# Altium schematic sheet HeatElement.SchDoc
size A; SheetNumber: 8; SheetTotal: 14
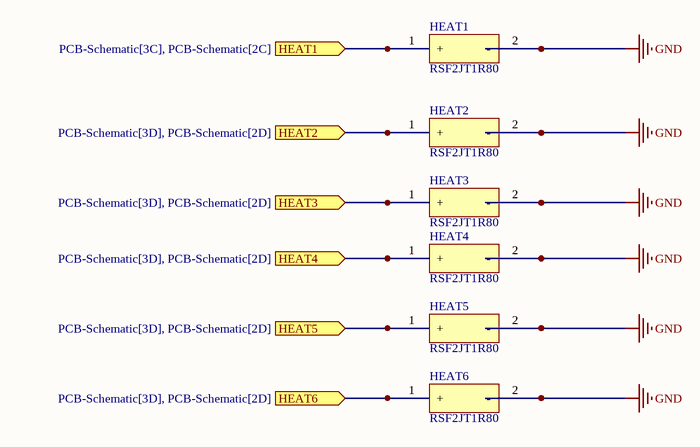
[diagram p0: HeatElement.SchDoc]

## Parts
HEAT1  RSF2JT1R80  [PCBComponent_1]
HEAT2  RSF2JT1R80  [PCBComponent_1]
HEAT3  RSF2JT1R80  [PCBComponent_1]
HEAT4  RSF2JT1R80  [PCBComponent_1]
HEAT5  RSF2JT1R80  [PCBComponent_1]
HEAT6  RSF2JT1R80  [PCBComponent_1]

## Ports
HEAT1 (in, see PCB-Schematic[3C], PCB-Schematic[2C]), HEAT2 (in, see PCB-Schematic[3D], PCB-Schematic[2D]), HEAT3 (in, see PCB-Schematic[3D], PCB-Schematic[2D]), HEAT4 (in, see PCB-Schematic[3D], PCB-Schematic[2D]), HEAT5 (in, see PCB-Schematic[3D], PCB-Schematic[2D]), HEAT6 (in, see PCB-Schematic[3D], PCB-Schematic[2D])

## Nets
GND: HEAT1.2(-) HEAT2.2(-) HEAT3.2(-) HEAT4.2(-) HEAT5.2(-) HEAT6.2(-)
HEAT1: HEAT1.1(+) ; port HEAT1
HEAT2: HEAT2.1(+) ; port HEAT2
HEAT3: HEAT3.1(+) ; port HEAT3
HEAT4: HEAT4.1(+) ; port HEAT4
HEAT5: HEAT5.1(+) ; port HEAT5
HEAT6: HEAT6.1(+) ; port HEAT6

## Library data of the parts
HEAT1-HEAT6 = Component_1